# Altium schematic sheet Block Diagram.SchDoc
size A2; SheetNumber: 1; SheetTotal: 3
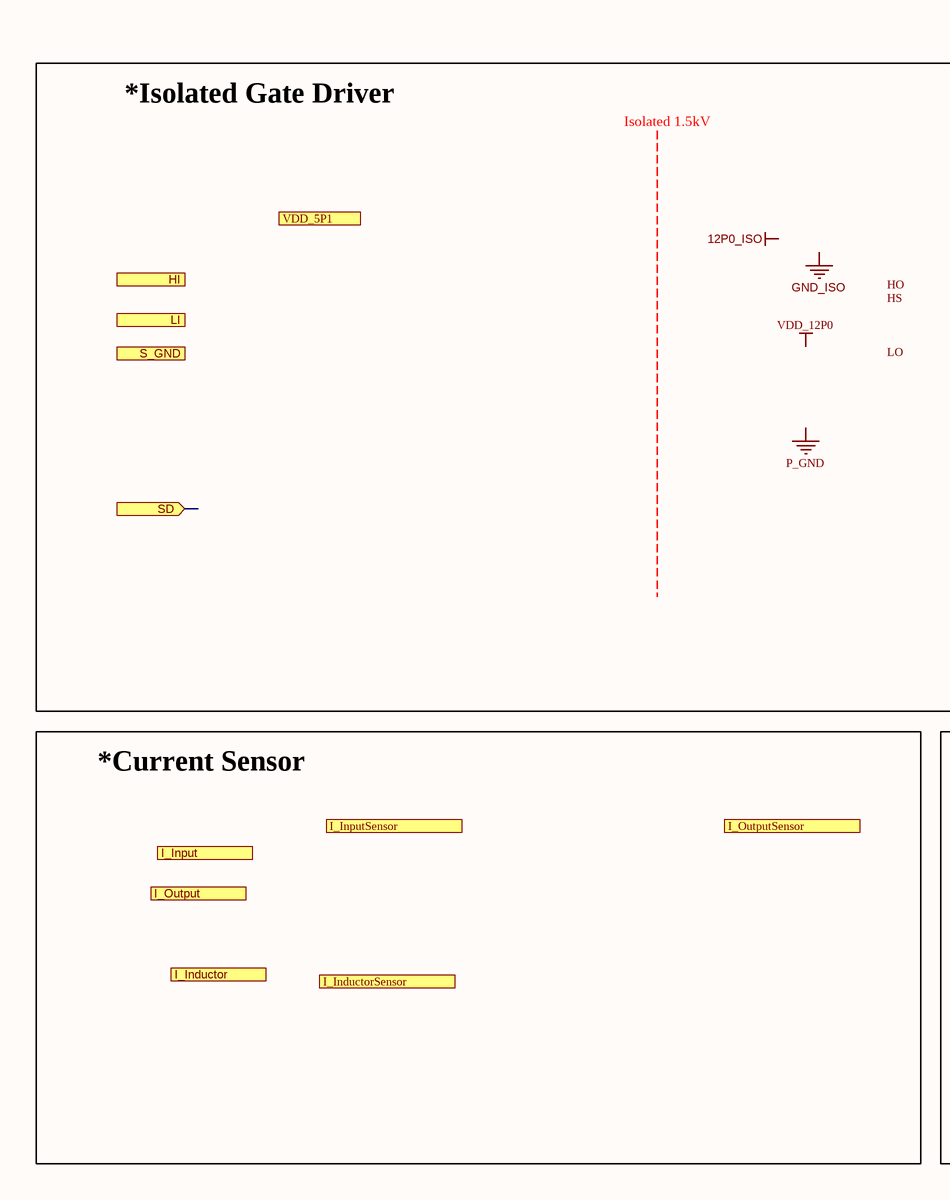
[diagram p0: Block Diagram.SchDoc, left]
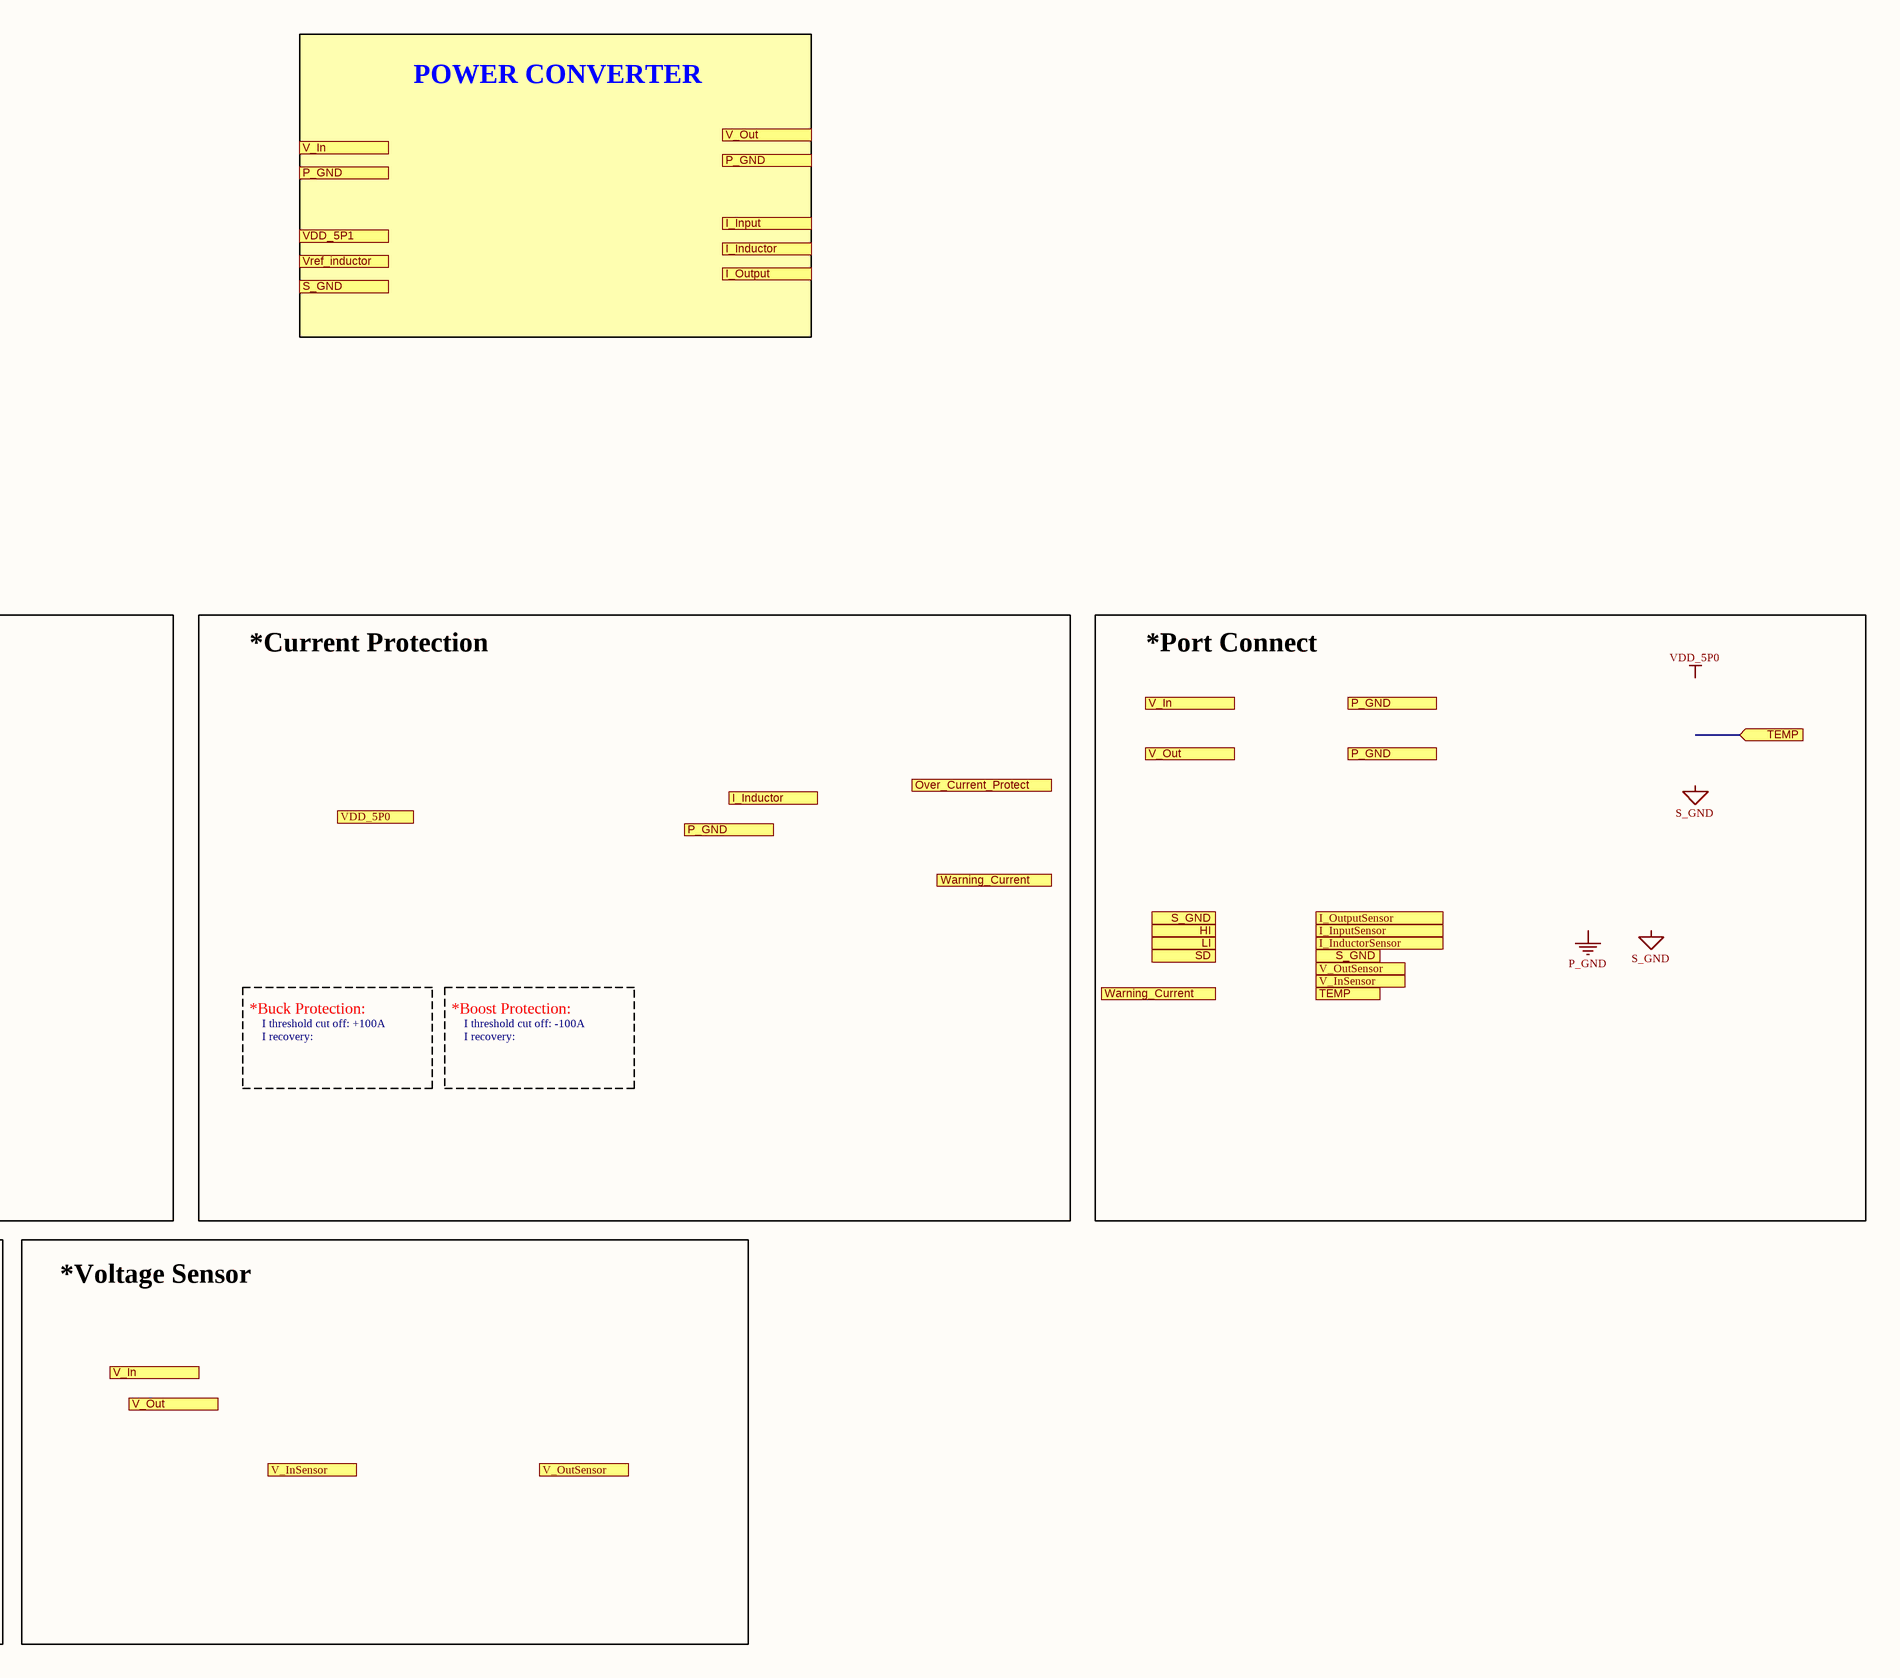
[diagram p1: Block Diagram.SchDoc, right]

## Ports
HI (in), I_Inductor (out), I_InductorSensor (out), I_Input (out), I_InputSensor (out), I_Output (out), I_OutputSensor (out), LI (in), Over_Current_Protect (out), P_GND (in), P_GND (out), S_GND (in), S_GND (out), SD (in), TEMP (in), V_In (in), V_InSensor (out), V_Out (out), V_OutSensor (out), VDD_5P0, VDD_5P1, VDD_5P1 (in), Vref_inductor (out), Warning_Current (out)

## Notes on the sheet
- POWER CONVERTER
- *Isolated Gate Driver
- Isolated 1.5kV
- *Current Protection
- *Port Connect
- *Buck Protection:
- I threshold cut off: +100A
- I recovery:
- *Boost Protection:
- I threshold cut off: -100A
- *Current Sensor
- *Voltage Sensor
- Labels drawn without touching a wire or pin: 12P0_ISO, GND_ISO, HO, HS, LO, P_GND, S_GND, VDD_5P0, VDD_12P0
- PMS POWER
- Title:
- Project:
- Draw:
- File Name:
- AnhDT
- Check:
- Approve:
- Sheet:
- 1
- Size:
- of
- A2
- Modified Date:
- Time:
- Date: